# EAGLE design tweeq-BLE4_EBLUE (EAGLE 7.2.0)
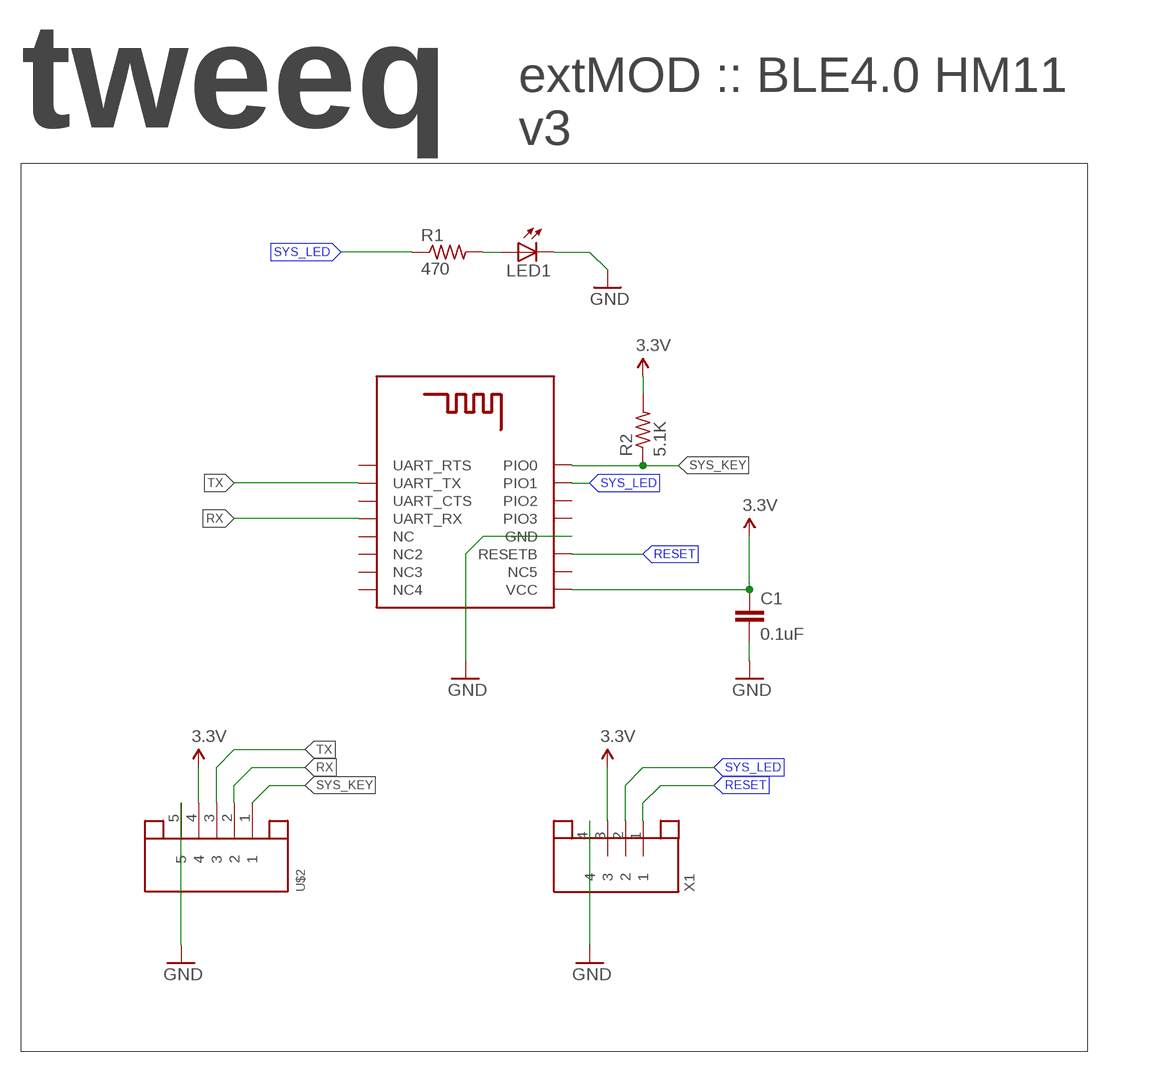
[diagram p0: schematic, sheet 1]

## Parts
C1  0.1uF  C-EUC0603K  [C0603K]
LED1  LEDCHIP-LED0805  [CHIP-LED0805]
R1  470  R-US_R0603  [R0603]
R2  5.1K  R-US_R0603  [R0603]
U$1  EBLUE_BLE4.0_HM11HM11  [BLE4.0_HM11]
U$2  JST-5PINEDGE  [SH1.0-5PIN/BLE_EDGE]
X1  JST-4PINSH-EDGE  [SH1.0-4PIN/BLE_EDGE]

## Nets
3.3V: C1.1 R2.2 U$1.P$9(VCC) U$2.4 X1.3
GND: C1.2 LED1.C U$1.P$12(GND) U$2.5 X1.4
N$4: LED1.A R1.2
RESET: U$1.P$11(RESETB) X1.1
RX: U$1.P$4(UART_RX) U$2.2
SYS_KEY: R2.1 U$1.P$16(PIO0) U$2.1
SYS_LED: R1.1 U$1.P$15(PIO1) X1.2
TX: U$1.P$2(UART_TX) U$2.3
Unconnected: U$1.P$1(UART_RTS) U$1.P$3(UART_CTS) U$1.P$5(NC) U$1.P$6(NC2) U$1.P$7(NC3) U$1.P$8(NC4) U$1.P$10(NC5) U$1.P$13(PIO3) U$1.P$14(PIO2)

## Notes on the sheet
- tweeq
- extMOD :: BLE4.0 HM11 
  v3

## Library data of the parts
C1 = AISCube:C-EU: CAPACITOR, European symbol
LED1 = AISCube:LED: LED OSRAM: - CHIPLED LG R971, LG N971, LY N971, LG Q971, LY Q971, LO R971, LY R971 LH N974, LH R974 LS Q976, LO Q976, LY Q976 LO Q996 - Hyper CHIPLED LW Q18S LB Q993, LB Q99A, LB R99A - SideLED LS A670, LO A670, LY A670, LG A670, LP A670 LB A673, LV A673, LT A673, LW A673 LH A674 LY A675 LS A676, LA A676, LO A676, LY A676, LW A676 LS A679, LY A679, LG A679 - Hyper Micro SIDELED® LS Y876, LA Y876, LO Y876, LY Y876 LT Y87S - SmartLED LW L88C, LW L88S LB L89C, LB L89S, LG L890 LS L89K, LO L89K, LY L89K LS L896, LA L896, LO L896, LY L896 - TOPLED LS T670, LO T670, LY T670, LG T670, LP T670 LSG T670, LSP T670, LSY T670, LOP T670, LYG T670 LG T671, LOG T671, LSG T671 LB T673, LV T673, LT T673, LW T673 LH T674 LS T676, LA T676, LO T676, LY T676, LB T676, LH T676, LSB T676, LW T676 LB T67C, LV T67C, LT T67C, LS T67K, LO T67K, LY T67K, LW E67C LS E67B, LA E67B, LO E67B, LY E67B, LB E67C, LV E67C, LT E67C LW T67C LS T679, LY T679, LG T679 LS T770, LO T770, LY T770, LG T770, LP T770 LB T773, LV T773, LT T773, LW T773 LH T774 LS E675, LA E675, LY E675, LS T675 LS T776, LA T776, LO T776, LY T776, LB T776 LHGB T686 LT T68C, LB T68C - Hyper Mini TOPLED® LB M676 - Mini TOPLED Santana® LG M470 LS M47K, LO M47K, LY M47K Source: http://www.osram.convergy.de/
R1 R2 = AISCube:R-US_: RESISTOR, American symbol
U$1 = AISCube:EBLUE_BLE4.0_HM11
U$2 = AISCube:JST-5PIN: JST 5 Pin
X1 = AISCube:JST-4PIN: JST 4 Pin

## Board
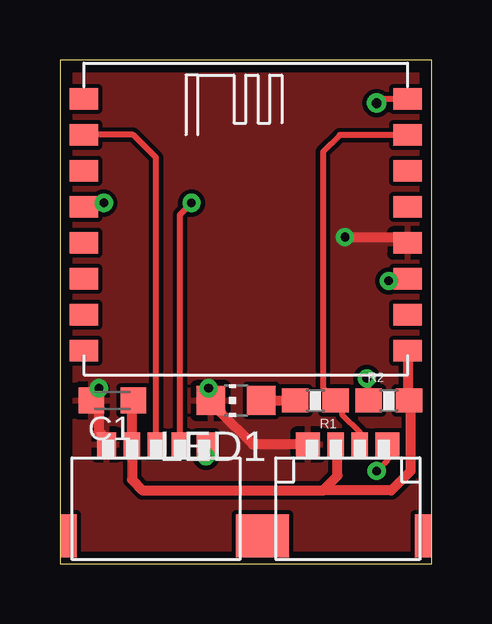
[diagram p1: board, top side]
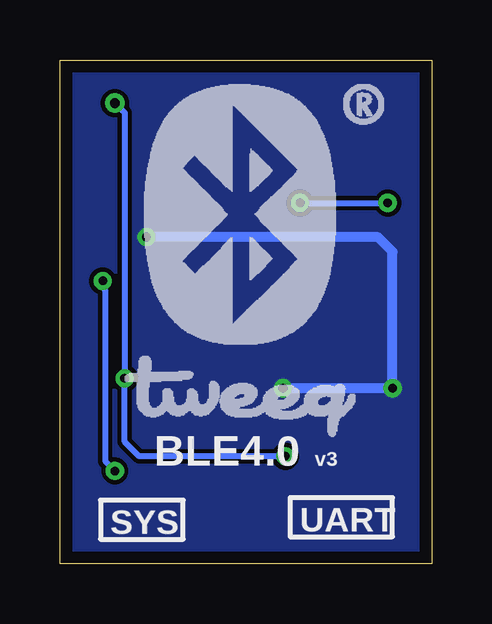
[diagram p2: board, bottom side, seen from below]

Size 15.5 x 21 mm. Coordinates in mm from the lower left corner, seen from the top.
Outline: 0,0 15.5,0 15.5,21 0,21 0,0
Copper layers (1*16): Top 0.0356mm / dielectric 1.5011mm / Bottom 0.0356mm
Design rules "AISCube": minimum track width 7mil, minimum drill 14mil, track to track 7mil, track to pad 7mil, pad to pad 7mil, via to via 7mil, smd to smd 0mil, copper to edge 20mil, drill to drill 8mil, minimum pad ring 10mil, minimum via ring 8mil, stop-mask expansion 4mil, vias tented up to drill 32mil, thermal gap 10mil

### Footprints (pad centres in the part's own frame; a part is rotated, then mirrored left to right if it is on the bottom)
C0603K = smd 1.05 x 1.08: 1 -0.875,0; 2 0.875,0
CHIP-LED0805 = smd 1.2 x 1.2: A 0,-1.05; C 0,1.05
R0603 = smd 1.1 x 1: 1 -0.85,0; 2 0.85,0
BLE4.0_HM11 = smd 1.2 x 0.9: P$1 -6.75,12; P$2 -6.75,10.5; P$3 -6.75,9; P$4 -6.75,7.5; P$5 -6.75,6; P$6 -6.75,4.5; P$7 -6.75,3; P$8 -6.75,1.5; P$9 6.75,1.5; P$10 6.75,3; P$11 6.75,4.5; P$12 6.75,6; P$13 6.75,7.5; P$14 6.75,9; P$15 6.75,10.5; P$16 6.75,12
SH1.0-5PIN/BLE_EDGE = smd 0.8 x 1: 1 -2.09,-0.55; 5 2.05,-0.55 | smd 0.7 x 1: 2 -1,-0.55; 3 0,-0.55; 4 1,-0.55 | smd 1 x 1.8: P$1 -3.85,3.25 | smd 0.7 x 1.8: P$2 3.65,3.25
SH1.0-4PIN/BLE_EDGE = smd 1 x 1: 1 -1.65,-0.55; 4 1.65,-0.55 | smd 0.7 x 1: 2 -0.5,-0.55; 3 0.5,-0.55 | smd 0.7 x 1.8: P$1 -3.15,3.25 | smd 1.2 x 1.8: P$2 3.05,3.25

### Placement (x,y rotation side)
C1  2.19,6.8 180 top
LED1  7.34,6.8 90 top
R1  10.66,6.8 180 top
R2  13.72,6.8 0 top
U$1  7.75,7.37 0 top
U$2  4,4.41 180 top
U$3  [LOGO_BLUETOOTH]  11.99,9.14 0 bottom
U$4  [TWEEQ-LOGO-M]  12.8,5.28 0 bottom
X1  12,4.41 180 top

### Tracks (layer width: path | path; a pad name or v marks a point on that pad's centre or on a via)
3.3V
  Top 0.406: 10.97,3.05 3.45,3.05 3,3.5 U$2.4 3,6.58 C1.1 | 10.97,3.05 11.58,3.66 11.58,4.88 X1.3 | 14.5,6.61 R2.2 | 10.97,3.05 13.82,3.05 14.63,3.86 14.63,6.42 R2.2 | U$1.P$9 14.5,6.85 R2.2
GND  (via drill 0.36)
  Top 0.254: LED1.C 6.29,7.22 v6.2,7.32
  Top 0.406: v1.63,7.32 1.59,7.28 C1.2 1.63,6.76 1.63,5.49 1.95,5.16 U$2.5 | v11.89,13.61 14.26,13.61 U$1.P$12 | X1.4 8.04,4.96 6.71,6.3 6.71,6.38 LED1.C
  Bottom 0.406: v11.89,13.61 2.23,13.61 1.63,13.01 v1.63,7.32 v6.2,7.32
  pour Top: 0.2,20.73 15.24,20.73 15.24,0.2 0.2,0.2
  pour Bottom: 0.2,20.73 15.24,20.73 15.24,0.2 0.2,0.2
N$4
  Top 0.406: LED1.A R1.2
RESET  (via drill 0.36)
  Top 0.254: v13.72,11.79 14.42,11.79 U$1.P$11 | X1.1 13.65,4.3 v13.21,3.86
  Bottom 0.254: v13.72,11.79 13.61,11.38 13.61,4.27 v13.21,3.86
RX  (via drill 0.36)
  Top 0.254: v1.83,15.04 1.17,15.04 U$1.P$4 | U$2.2 5,14.55 v5.49,15.04
  Bottom 0.254: v5.49,15.04 v1.83,15.04
SYS_KEY  (via drill 0.36, 0.41)
  Top 0.254: U$2.1 v6.09,4.48 v6.1,4.47 | U$1.P$16 13.38,19.37 v13.21,19.2 | R2.1 12.87,7.66 v12.8,7.72
  Bottom 0.254: v6.1,4.47 12.19,4.47 12.8,5.08 v12.8,7.72 12.8,18.8 v13.21,19.2
SYS_LED
  Top 0.254: U$1.P$15 11.67,17.87 10.97,17.17 10.97,7.33 R1.1 | 11.48,6.82 R1.1 | X1.2 12.5,5.48 11.79,6.2 11.79,6.52 R1.1
TX
  Top 0.254: U$2.3 4,16.93 3.05,17.88 1.01,17.88 U$1.P$2

### Text on the board
bPlace: v3 | BLE4.0 | UART | SYS